# EAGLE design M8-420mA (EAGLE 9.6.2)
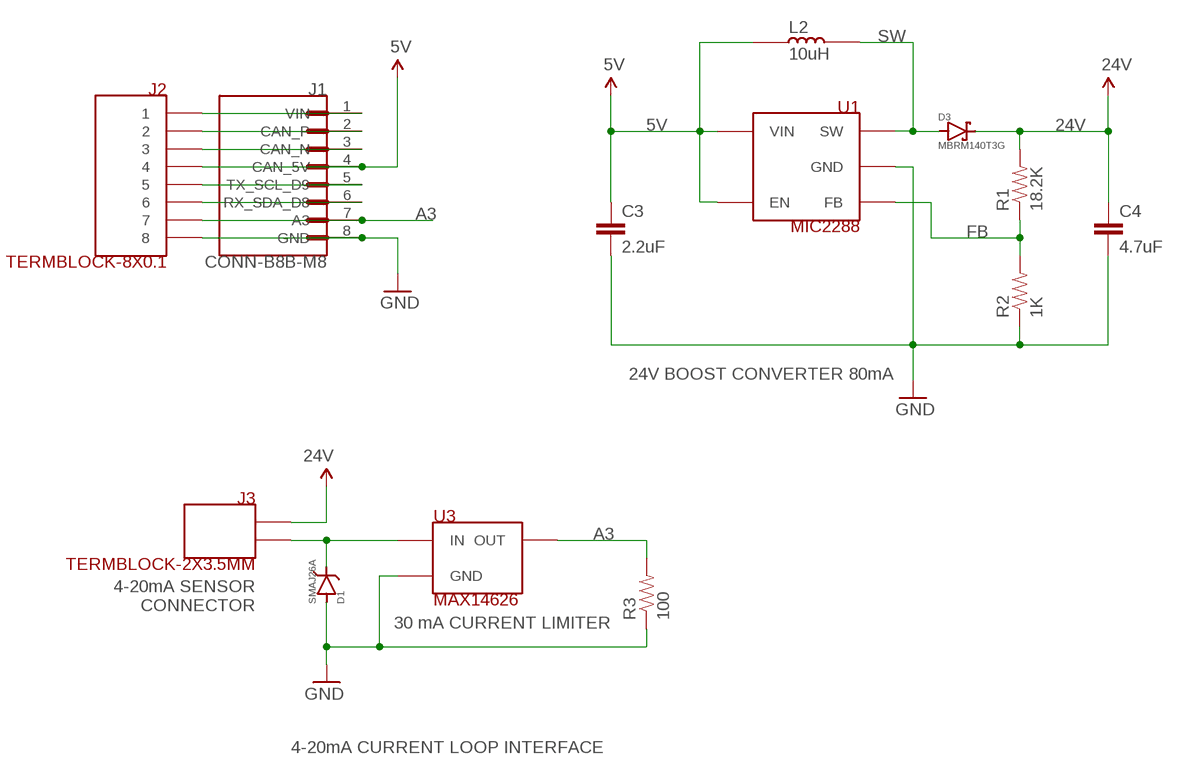
[diagram p0: schematic, sheet 1]

## Parts
C3  2.2uF  CAP-2.2UF-0603  [0603-CAP]
C4  4.7uF  CAP-4.7UF-25V-0805  [0805]
D1  SMAJ26A  DIODE-TVS-SMAJ26A  [DO-214AC-LITTELFUSE]
D3  MBRM140T3G  [MBRM140T3G]
J1  CONN-B8B-M8  [JST_B8B-PH-SM4-TB(LF)(SN)]
J2  TERMBLOCK-8X0.1  [TERMBLOCK-8X0.1]
J3  TERMBLOCK-2X3.5MM  [TERMBLOCK-2X3.5MM]
L2  10uH  INDUCTOR-10UH  [BOURNS-INDUCTOR-3X3]
R1  18.2K  RES-18.2K-06030603  [0603-RES]
R2  1K  RES-1K-0603  [0603-RES]
R3  100  RES-100-0603.DEV  [0603-RES]
U1  MIC2288  [TSOT23-5-MICROCHIP]
U3  MAX14626  [6-TDFN-MAXIM]

## Nets
5V: C3.1 J1.4(CAN_5V) J2.P$4 L2.1 U1.4(EN) U1.5(VIN)
24V: C4.1 D3.1(CATHODE) J3.1 R1.2
A3: J1.7(A3) J2.P$7 R3.2 U3.6(OUT)
CAN_N: J1.3(CAN_N) J2.P$3
CAN_P: J1.2(CAN_P) J2.P$2
FB: R1.1 R2.2 U1.3(FB)
GND: C3.2 C4.2 D1.A(ANODE) J1.8(GND) J2.P$8 R2.1 R3.1 U1.2(GND) U3.2(GND) U3.3(GND) U3.4(GND) U3.5(GND) U3.EP(GND)
N$2: J1.5(TX_SCL_D9) J2.P$5
SDA: J1.6(RX_SDA_D8) J2.P$6
SEN1: D1.C(CATHODE) J3.2 U3.1(IN)
SW: D3.2(ANODE) L2.2 U1.1(SW)
VIN: J1.1(VIN) J2.P$1

## Notes on the sheet
- 24V BOOST CONVERTER 80mA
- 4-20mA SENSOR
  CONNECTOR
- 30 mA CURRENT LIMITER
- 4-20mA CURRENT LOOP INTERFACE

## Library data of the parts
C3 = rickk2:CAP-2.2UF-0603: Murata Electronics North America GRM188R61E225KA12D CAP CER 2.2UF 25V X5R 0603 2.2µF ±10% 25V Ceramic Capacitor X5R 0603 (1608 Metric) https://www.digikey.com/product-detail/en/murata-electronics-north-america/GRM188R61E225KA12D/490-10731-1-ND/5251369
C4 = rickk2:CAP-4.7UF-25V-0805: Not ordered yet Murata Electronics GRM219R61E475MA73D $0.30 CAP CER 4.7UF 25V X5R 0805 4.7µF ±20% 25V Ceramic Capacitor X5R 0805 (2012 Metric) https://www.digikey.com/product-detail/en/murata-electronics/GRM219R61E475MA73D/490-14644-1-ND/6606250
D1 = rickk2:DIODE-TVS-SMAJ26A: Not ordered yet TVS diode for 24V 4-20mA circuits Littelfuse Inc. SMAJ26A $ 0.36 TVS DIODE 26V 42.1V DO214AC 42.1V Clamp 9.5A Ipp Tvs Diode Surface Mount DO-214AC (SMA) https://www.digikey.com/product-detail/en/littelfuse-inc/SMAJ26A/SMAJ26ALFCT-ND/762502 Cathode (bar/stripe side) goes to signal, anode goes to GND
D3 = rickk2:MBRM140T3G: Not ordered yet Schottky Diode for 24V boost with MIC2288 ON Semiconductor MBRM140T3G $0.36 DIODE SCHOTTKY 40V 1A POWERMITE Diode Schottky 40V 1A Surface Mount Powermite https://www.digikey.com/product-detail/en/on-semiconductor/MBRM140T3G/MBRM140T3GOSCT-ND/917997
J1 = rickk2:CONN-B8B-M8: PH Series 2 mm Pitch 12 Position SMT Single Row Top Entry Shrouded Header
J2 = rickk2:TERMBLOCK-8X0.1: Term Block 8x0.1" 20-30AWG 6A 125V Max Side Entry On Shore Technology Inc. OSTVN08A150 TERM BLK 8P SIDE ENT 2.54MM PCB 8 Position Wire to Board Terminal Block Horizontal with Board 0.100" (2.54mm) Through Hole https://www.digikey.com/product-detail/en/on-shore-technology-inc/OSTVN08A150/ED10566-ND/1588868
J3 = rickk2:TERMBLOCK-2X3.5MM: TERM BLK 2POS SIDE ENT 3.5MM PCB $0.67 On Shore Technology Inc. OSTTE020161M https://www.digikey.com/products/en?keywords=ED2635-ND
L2 = rickk2:INDUCTOR-10UH: Bourns Inc. SRN3015-100M $0.46 FIXED IND 10UH 1A 276 MOHM SMD 10µH Semi-Shielded Wirewound Inductor 1A 276 mOhm Max Nonstandard https://www.digikey.com/product-detail/en/bourns-inc/SRN3015-100M/SRN3015-100MCT-ND/2756149
R1 = rickk2:RES-18.2K-0603: Panasonic Electronic Components ERJ-PB3B1822V $0.25 RES SMD 18.2K OHM 0.1% 1/5W 0603 18.2 kOhms ±0.1% 0.2W, 1/5W Chip Resistor 0603 (1608 Metric) Automotive AEC-Q200, Pulse Withstanding Thick Film https://www.digikey.com/product-detail/en/panasonic-electronic-components/ERJ-PB3B1822V/P20114CT-ND/6214369
R2 = rickk2:RES-1K-0603: RES SMD 1K OHM 0.5% 1/5W 0603 $ 0.17 https://www.digikey.com/product-detail/en/panasonic-electronic-components/ERJ-PB3D1001V/P20283CT-ND/6214538 Panasonic
R3 = rickk2:RES-100-0603.DEV: RES SMD 100 OHM 5% 1/10W 0603 $ 0.10 ±5% 0.1W, 1/10W Chip Resistor 0603 (1608 Metric) Automotive AEC-Q200 Thick Film https://www.digikey.com/product-detail/en/panasonic-electronic-components/ERJ-3GEYJ101V/P100GCT-ND/134714
U1 = rickk2:MIC2288: Microchip Technology MIC2288YD5-TR $0.56 **don't have in stock** IC REG BOOST ADJ 1.2A TSOT23-5 Boost Switching Regulator IC Positive Adjustable 2.5V 1 Output 1.2A (Switch) SOT-23-5 Thin, TSOT-23-5 Originally ordered the wrong chip: https://www.digikey.com/product-detail/en/microchip-technology/MIC2619YD6-TR/576-3655-1-ND/2339666
U3 = rickk2:MAX14626: Not ordered yet Current limiter 30mA for 4-20mA current loop Maxim Integrated MAX14626ETT+T $1.32 IC CURR LOOP PROT 4-20MA 6TDFN https://www.digikey.com/product-detail/en/maxim-integrated/MAX14626ETT-T/MAX14626ETT-TCT-ND/4245424

## Board
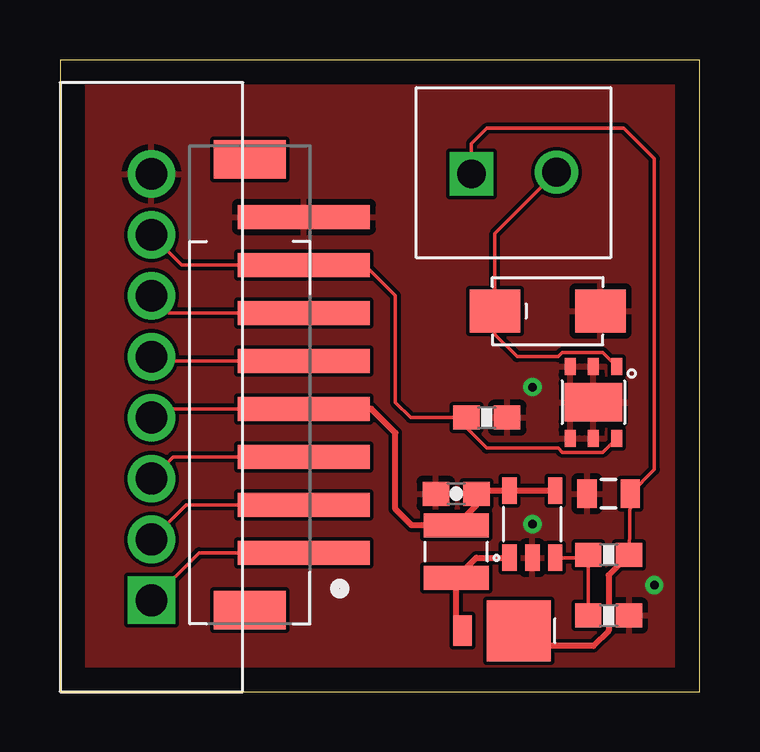
[diagram p1: board, top side]
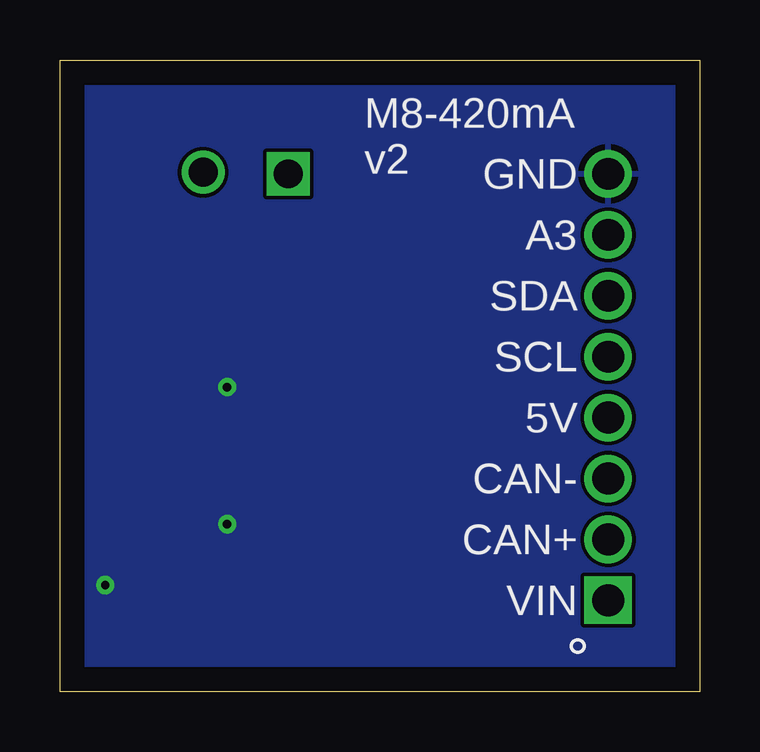
[diagram p2: board, bottom side, seen from below]

Size 26.65 x 26.34 mm. Coordinates in mm from the lower left corner, seen from the top.
Outline: 0,0 26.65,0 26.65,26.34 0,26.34 0,0
Copper layers (1*16): Top 0.035mm / dielectric 1.5mm / Bottom 0.035mm
Design rules "default": minimum track width 6mil, minimum drill 0.35mm, track to track 6mil, track to pad 6mil, pad to pad 6mil, via to via 6mil, smd to smd 6mil, copper to edge 40mil, drill to drill 6mil, minimum pad ring 10mil, minimum via ring 8mil, stop-mask expansion 4mil, vias tented up to drill 0mil, thermal gap 10mil

### Footprints (pad centres in the part's own frame; a part is rotated, then mirrored left to right if it is on the bottom)
0603-CAP = smd 1.1 x 1: 1 -0.85,0; 2 0.85,0
0805 = smd 0.8 x 1.2: 1 -0.9,0; 2 0.9,0
DO-214AC-LITTELFUSE = smd 2.1 x 1.8: A 2.2,0; C -2.2,0
MBRM140T3G = smd 2.67 x 2.54: 1 -0.695,0 | smd 0.762 x 1.27: 2 1.65,0
JST_B8B-PH-SM4-TB(LF)(SN) = smd 1 x 5.5: 1 -5,0; 2 -3,0; 3 -1,0; 4 1,0; 5 3,0; 6 5,0; 7 7,0; 8 9,0 | smd 1.6 x 3: P1 -7.4,2.25; P2 11.4,2.25
TERMBLOCK-8X0.1 = drill 1.321 square: P$1 -8.89,0 | drill 1.321: P$2 -6.35,0; P$3 -3.81,0; P$4 -1.27,0; P$5 1.27,0; P$6 3.81,0; P$7 6.35,0; P$8 8.89,0
TERMBLOCK-2X3.5MM = drill 1.2 square: 1 0,0 | drill 1.2: 2 3.54,0.07
BOURNS-INDUCTOR-3X3 = smd 2.7 x 1: 1 0,1.1; 2 0,-1.1
0603-RES = smd 1.1 x 1: 1 -0.85,0; 2 0.85,0
TSOT23-5-MICROCHIP = smd 0.6 x 1.1: 1 -0.95,-1.4; 2 0,-1.4; 3 0.95,-1.4; 4 0.95,1.4; 5 -0.95,1.4
6-TDFN-MAXIM = smd 0.46 x 0.71: 1 -0.965,-1.5; 2 0,-1.5; 3 0.965,-1.5; 4 0.965,1.5; 5 0,1.5; 6 -0.965,1.5 | smd 2.39 x 1.6: EP 0,0

### Placement (x,y rotation side)
C3  16.51,8.26 180 top
C4  22.86,8.26 180 top
D1  20.32,15.88 0 top
D3  18.41,2.54 180 top
J1  10.16,10.79 90 top
J2  3.81,12.7 90 top
J3  17.14,21.59 0 top
L2  16.51,5.84 0 top
R1  22.86,5.71 0 top
R2  22.86,3.17 180 top
R3  17.78,11.43 180 top
U1  19.68,6.99 0 top
U3  22.23,12.06 180 top

### Tracks (layer width: path | path; a pad name or v marks a point on that pad's centre or on a via)
5V
  Top 0.152: J1.4 4.17,11.79 J2.P$4
  Top 0.254: U1.4 U1.5 17.49,8.38 C3.1 17.36,7.79 L2.1 14.65,6.94 13.97,7.62 13.97,10.79 12.97,11.79 J1.4
24V
  Top 0.152: R1.2 C4.1 24.77,9.26 24.77,22.23 23.5,23.5 17.78,23.5 17.14,22.86 J3.1
  Top 0.254: R1.2 22.86,4.87 22.86,2.54 22.23,1.91 19.11,1.91 D3.1
A3
  Top 0.152: J2.P$7 5.07,17.8 J1.7 10.18,17.78 12.7,17.78 13.97,16.51 13.97,12.06 14.61,11.43 R3.2 16.93,11.01 17.78,10.16 20.76,10.16 20.93,9.98 22.61,9.98 U3.6
CAN_N
  Top 0.152: J1.3 4.71,9.79 J2.P$3
CAN_P
  Top 0.152: J1.2 5.25,7.79 J2.P$2
FB
  Top 0.152: U1.3 21.88,5.58 R1.1 R2.2
GND  (via drill 0.35)
  other vias: 24.77,4.45 19.68,6.99 19.68,12.7
  pour Top: 0,0 0,29.21 35.56,29.21 35.56,0
  pour Bottom: 0,0 0,30.48 36.83,30.48 36.83,0
N$2
  Top 0.152: J1.5 3.98,13.79 J2.P$5
SDA
  Top 0.152: J1.6 4.53,15.79 J2.P$6
SEN1
  Top 0.152: U3.1 22.61,14.15 20.93,14.15 20.76,13.97 19.05,13.97 18.12,14.9 D1.C 18.12,19.09 J3.2
SW
  Top 0.254: U1.1 17.35,5.58 L2.2 16.51,2.54 D3.2
VIN
  Top 0.152: J2.P$1 5.79,5.79 J1.1

### Text on the board
bPlace: GND | M8-420mA / v2 | A3 | SDA | SCL | 5V | CAN- | CAN+ | VIN